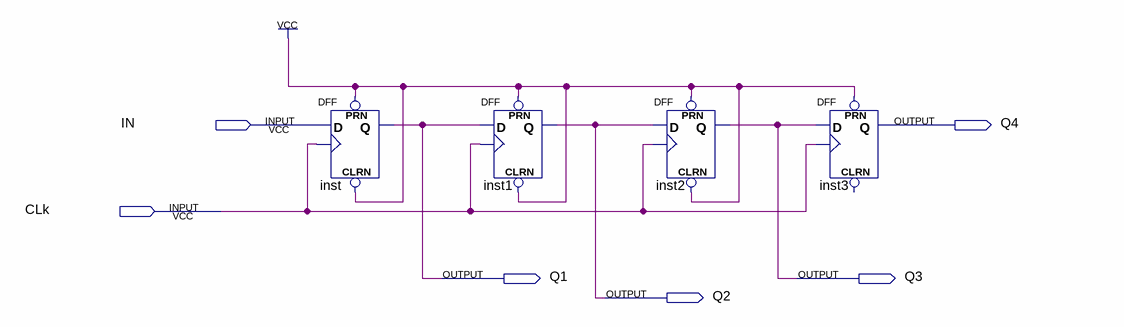
[diagram p0: schematic sheet]
// Quartus schematic lab10step1.bdf as structural Verilog: 4 symbols, 6 pins
module lab10step1 (
  input  IN,
  input  CLk,
  output Q4,
  output Q1,
  output Q3,
  output Q2
);

  DFF inst (.CLRN(1'b1), .CLK(CLk), .D(IN), .PRN(1'b1), .Q(Q1));
  DFF inst1 (.CLRN(1'b1), .CLK(CLk), .D(Q1), .PRN(1'b1), .Q(Q2));
  DFF inst2 (.CLRN(1'b1), .CLK(CLk), .D(Q2), .PRN(1'b1), .Q(Q3));
  DFF inst3 (.CLK(CLk), .D(Q3), .PRN(1'b1), .Q(Q4));  // open: CLRN
endmodule
